# EAGLE design v3 Tensegrity Motherboard (EAGLE 9.6.2)
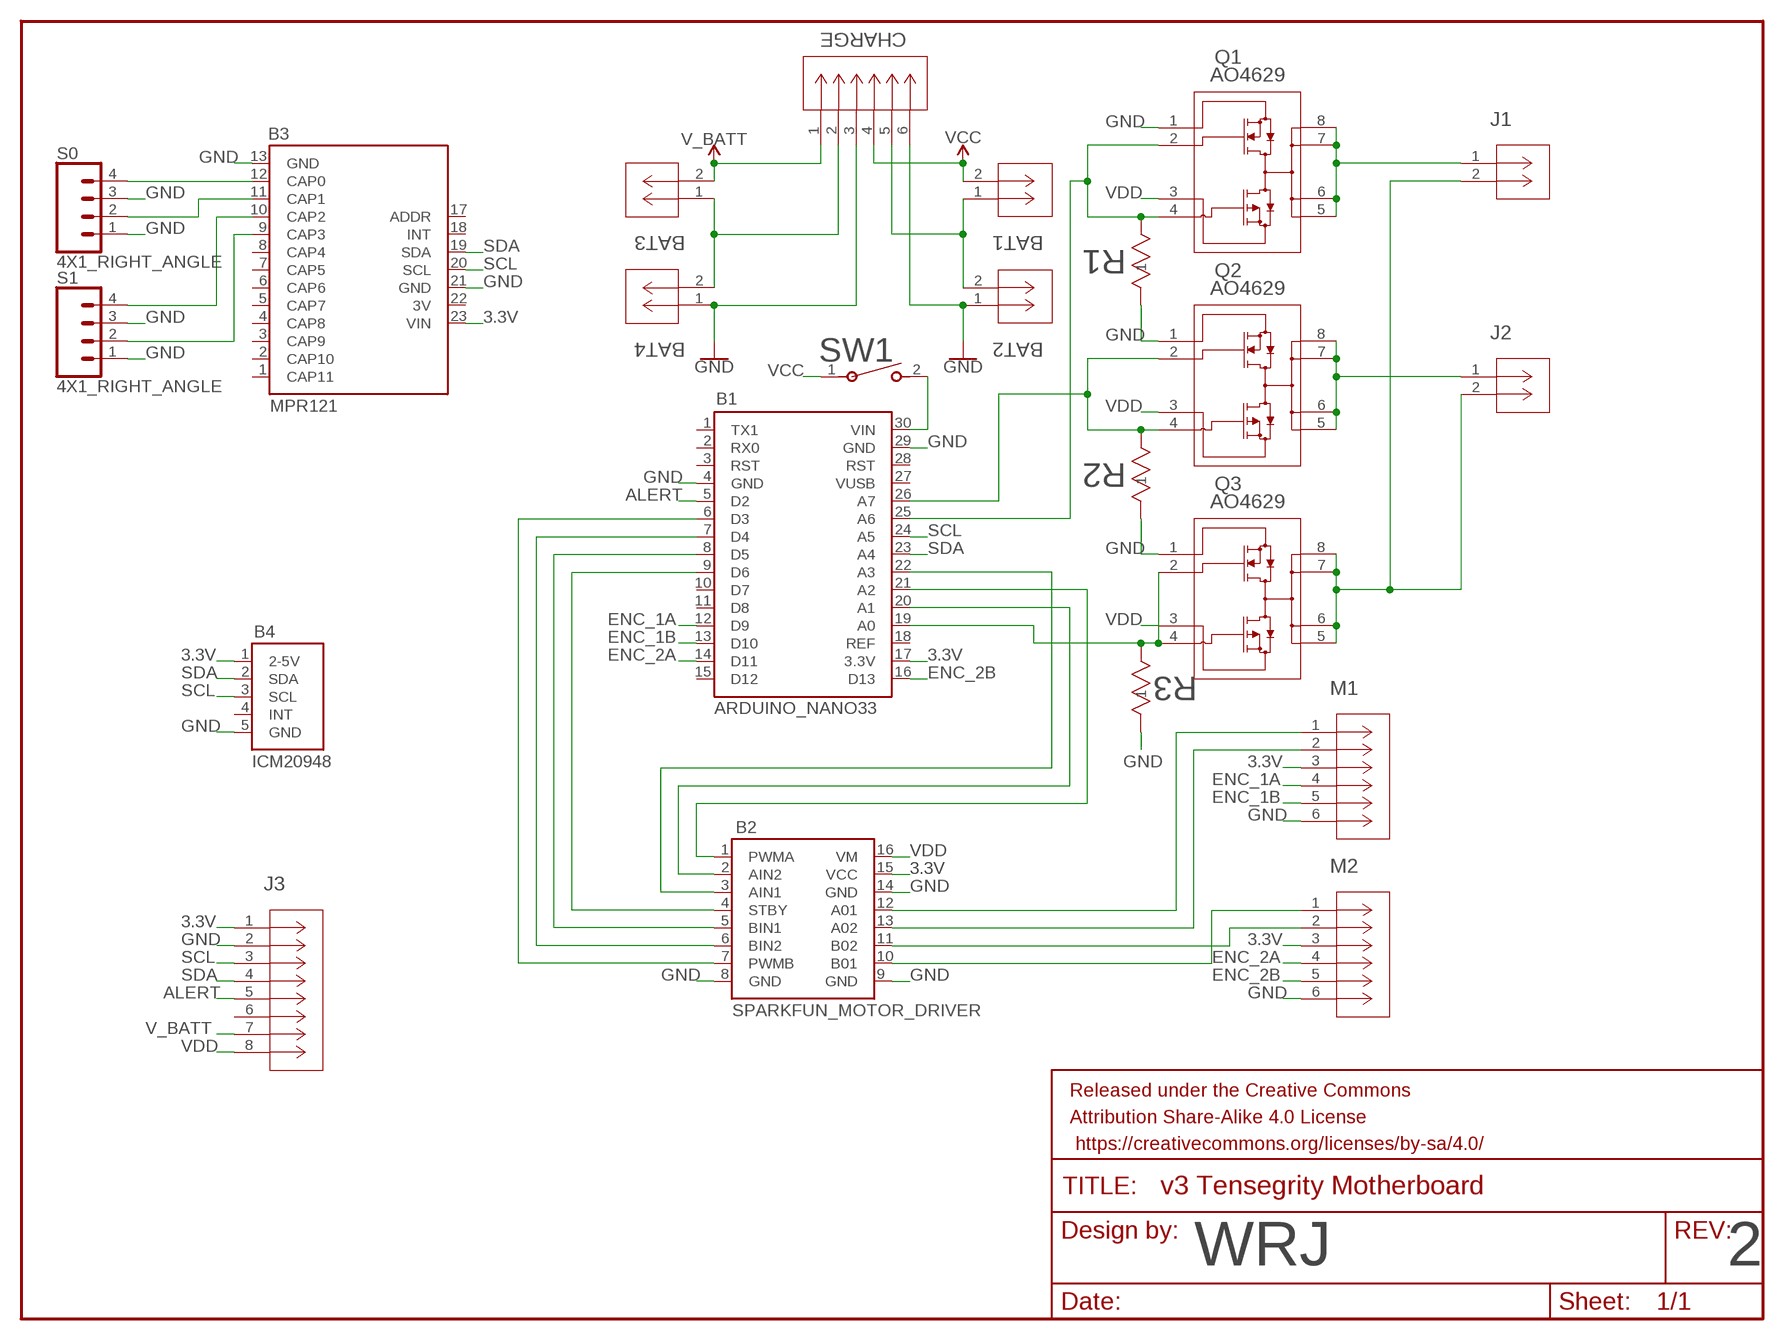
[diagram p0: schematic, sheet 1]

## Parts
B1  ARDUINO_NANO33  [HDRVR30W64P1524X254_2X15_3810X1778X851B]
B2  SPARKFUN_MOTOR_DRIVER  [HDRVR16W64P1524X254_2X8_2032X2032X254B]
B3  MPR121  [HDRVR26W64P1524X254_2X13_3302X1905X851B]
B4  ICM20948  [HDRVR5W64P254_1X5_1270X254X851B]
BAT1  S2B-PH-K-S(LF)(SN)  [CONN_S2B-PH-K-S_JST]
BAT2  S2B-PH-K-S(LF)(SN)  [CONN_S2B-PH-K-S_JST]
BAT3  S2B-PH-K-S(LF)(SN)  [CONN_S2B-PH-K-S_JST]
BAT4  S2B-PH-K-S(LF)(SN)  [CONN_S2B-PH-K-S_JST]
CHARGE  S6B-XH-A  [CONN_S6B-XH-A_JST]
FRAME1  FRAME-LETTER  [CREATIVE_COMMONS]
J1  S2B-XH-A-1(LF)(SN)  [CONN_S2B-XH-A-1(LF)(SN)_JST]
J2  S2B-XH-A-1(LF)(SN)  [CONN_S2B-XH-A-1(LF)(SN)_JST]
J3  PEC08SAAN  [CONN_XXC08SAAN_SUL]
M1  BM06B-SRSS-TB(LF)(SN)  [CONN_BM06B-SRSS-TB_JST]
M2  BM06B-SRSS-TB(LF)(SN)  [CONN_BM06B-SRSS-TB_JST]
Q1  AO4629  [SO8(SOP-8L)_AOS]
Q2  AO4629  [SO8(SOP-8L)_AOS]
Q3  AO4629  [SO8(SOP-8L)_AOS]
R1  RC0603FR-071KL  [RC0603N_YAG]
R2  RC0603FR-071KL  [RC0603N_YAG]
R3  RC0603FR-071KL  [RC0603N_YAG]
S0  4X1_RIGHT_ANGLE  [HDRRA4W64P254_1X4_1016X254X278B]
S1  4X1_RIGHT_ANGLE  [HDRRA4W64P254_1X4_1016X254X278B]
SW1  GPTS203212B  [SW_GPTS203212B_CWI]

## Nets
3.3V: B1.17(3.3V) B2.15(VCC) B3.23(VIN) B4.1(2-5V) J3.1 M1.3 M2.3
ALERT: B1.5(D2) J3.5
ENC_1A: B1.12(D9) M1.4
ENC_1B: B1.13(D10) M1.5
ENC_2A: B1.14(D11) M2.4
ENC_2B: B1.16(D13) M2.5
GND: B1.4(GND) B1.29(GND) B2.8(GND) B2.9(GND) B2.14(GND) B3.13(GND) B3.21(GND) B4.5(GND) BAT2.1 BAT4.1 CHARGE.3 CHARGE.6 J3.2 M1.6 M2.6 Q1.1 Q2.1 Q3.1 R1.1 R2.1 R3.1 S0.1 S0.3 S1.1 S1.3
N$1: BAT1.1 BAT2.2 CHARGE.5
N$2: BAT3.1 BAT4.2 CHARGE.2
N$3: B1.6(D3) B2.7(PWMB)
N$4: B1.7(D4) B2.6(BIN2)
N$5: B1.8(D5) B2.5(BIN1)
N$6: B1.9(D6) B2.4(STBY)
N$7: B1.21(A2) B2.1(PWMA)
N$8: B1.20(A1) B2.2(AIN2)
N$9: B1.22(A3) B2.3(AIN1)
N$10: B2.12(A01) M1.1
N$11: B2.13(A02) M1.2
N$12: B2.11(B02) M2.2
N$13: B2.10(B01) M2.1
N$14: B1.30(VIN) SW1.2
N$15: B3.12(CAP0) S0.4
N$16: B3.11(CAP1) S0.2
N$17: B3.10(CAP2) S1.4
N$18: B3.9(CAP3) S1.2
N$19: B1.26(A7) Q2.2 Q2.4 R2.2
N$20: B1.25(A6) Q1.2 Q1.4 R1.2
N$21: J1.2 J2.2 Q3.5 Q3.6 Q3.7 Q3.8
N$22: B1.19(A0) Q3.2 Q3.4 R3.2
N$23: J2.1 Q2.5 Q2.6 Q2.7 Q2.8
N$25: J1.1 Q1.5 Q1.6 Q1.7 Q1.8
SCL: B1.24(A5) B3.20(SCL) B4.3(SCL) J3.3
SDA: B1.23(A4) B3.19(SDA) B4.2(SDA) J3.4
V_BATT: BAT3.2 CHARGE.1 J3.7
VCC: BAT1.2 CHARGE.4 SW1.1
VDD: B2.16(VM) J3.8 Q1.3 Q2.3 Q3.3
Unconnected: B1.1(TX1) B1.2(RX0) B1.3(RST) B1.10(D7) B1.11(D8) B1.15(D12) B1.18(REF) B1.28(RST) B3.1(CAP11) B3.2(CAP10) B3.3(CAP9) B3.4(CAP8) B3.5(CAP7) B3.6(CAP6) B3.7(CAP5) B3.8(CAP4) B3.17(ADDR) B3.18(INT) B4.4(INT) J3.6

## Notes on the sheet
- WRJ | 2

## Power pins joined to a net without a drawn wire
3V: B3.22(3V)
VUSB: B1.27(VUSB)

## Library data of the parts
B1 = Arduino Nano 33 IoT:ARDUINO_NANO33: Arduino Nano 33 IoT
B2 = SparkFun Motor Driver - Dual TB6612FNG Breakout:SPARKFUN_MOTOR_DRIVER: This device is for the SparkFun Motor Driver - Dual TB6612FNG (with Headers). It allows users to design carrier boards for this commerical breakout.
B3 = MPR121:MPR121: Adafruit MPR121 Capacitive Sensing Breakout Board, for making carrier boards
B4 = ICM20948:ICM20948
BAT1-BAT4 = JST Connectors:S2B-PH-K-S(LF)(SN): JST PH Connector 2pos for LiPo battery Through-hole mounting Sold by DigiKey <https://www.digikey.com/en/products/detail/jst-sales-america-inc/S2B-PH-K-S/926626>; COPYRIGHT: Copyright (C) 2024 Ultra Librarian. All rights reserved.; MANUFACTURER_PART_NUMBER: S2B-PH-K-S(LF)(SN); MFR_NAME: JST
CHARGE = JST Connectors:S6B-XH-A: JST XH connector for LiPo battery charging. Can support balance charging for 2 packs of 2S LiPo batteries via ViFly 2S battery charger <https://viflydrone.com/products/vifly-toothstor-4-port-2s-balance-charger-with-storage-mode?variant=48130105639208>. Through-hole connector sold by Digikey <https://www.digikey.com/en/products/detail/jst-sales-america-inc/S6B-XH-A/1651034>.; COPYRIGHT: Copyright (C) 2024 Ultra Librarian. All rights reserved.; MANUFACTURER_PART_NUMBER: S6B-XH-A; MFR_NAME: JST
FRAME1 = SparkFun-Aesthetics:FRAME-LETTER: Schematic Frame - Letter Standard 8.5x11 US Letter frame
J1 J2 = JST Connectors:S2B-XH-A-1(LF)(SN): JST XH 2pos through-hole connector sold by DigiKey <https://www.digikey.com/en/products/detail/jst-sales-america-inc/S2B-XH-A-1/9961922> for EP Magnet connector.; COPYRIGHT: Copyright (C) 2024 Ultra Librarian. All rights reserved.; MANUFACTURER_PART_NUMBER: S2B-XH-A-1(LF)(SN); MFR_NAME: JST
J3 = Headers:PEC08SAAN: Male header pins from DigiKey <https://www.digikey.com/en/products/detail/sullins-connector-solutions/PEC08SAAN/859161>.; COPYRIGHT: Copyright (C) 2024 Ultra Librarian. All rights reserved.; MANUFACTURER_PART_NUMBER: PEC08SAAN; MFR_NAME: Sullins; TYPE: Headers, Male Pins
M1 M2 = JST Connectors:BM06B-SRSS-TB(LF)(SN): JST SH 6pos connector surface mount for Pololu Micro Metal Gearmotor with Encoder <https://www.pololu.com/product/5192>. Connector sold by DigiKey <https://www.digikey.com/en/products/detail/jst-sales-america-inc/BM06B-SRSS-TB/926698>.; COPYRIGHT: Copyright (C) 2024 Ultra Librarian. All rights reserved.; MANUFACTURER_PART_NUMBER: BM06B-SRSS-TB(LF)(SN); MFR_NAME: JST
Q1-Q3 = Transistors:AO4629: MOSFET N/P-CH 30V 6A/5.5A AO4629 <https://www.digikey.com/en/products/detail/alpha-omega-semiconductor-inc/AO4629/3152394>.; COPYRIGHT: Copyright (C) 2024 Ultra Librarian. All rights reserved.; MANUFACTURER_PART_NUMBER: AO4629; MFR_NAME: Alpha and Omega Semiconductor
R1-R3 = Resistors:RC0603FR-071KL: 1kΩ resistor 311-1.00KHRTR-ND from DigiKey <https://www.digikey.com/en/products/detail/yageo/RC0603FR-071KL/726843>.; COPYRIGHT: Copyright (C) 2024 Ultra Librarian. All rights reserved.; MANUFACTURER_PART_NUMBER: RC0603FR-071KL; MFR_NAME: Yageo
S0 S1 = 4x1 male headers right angle:4X1_RIGHT_ANGLE
SW1 = Switches:GPTS203212B: SPST Pushbutton Off-On switch GPTS203212B <https://www.digikey.com/en/products/detail/cw-industries/GPTS203212B/3190592> by CW Industries.; COPYRIGHT: Copyright (C) 2024 Ultra Librarian. All rights reserved.; MANUFACTURER_PART_NUMBER: GPTS203212B; MFR_NAME: CW Industries; TYPE: Pushbutton Switches

## Board
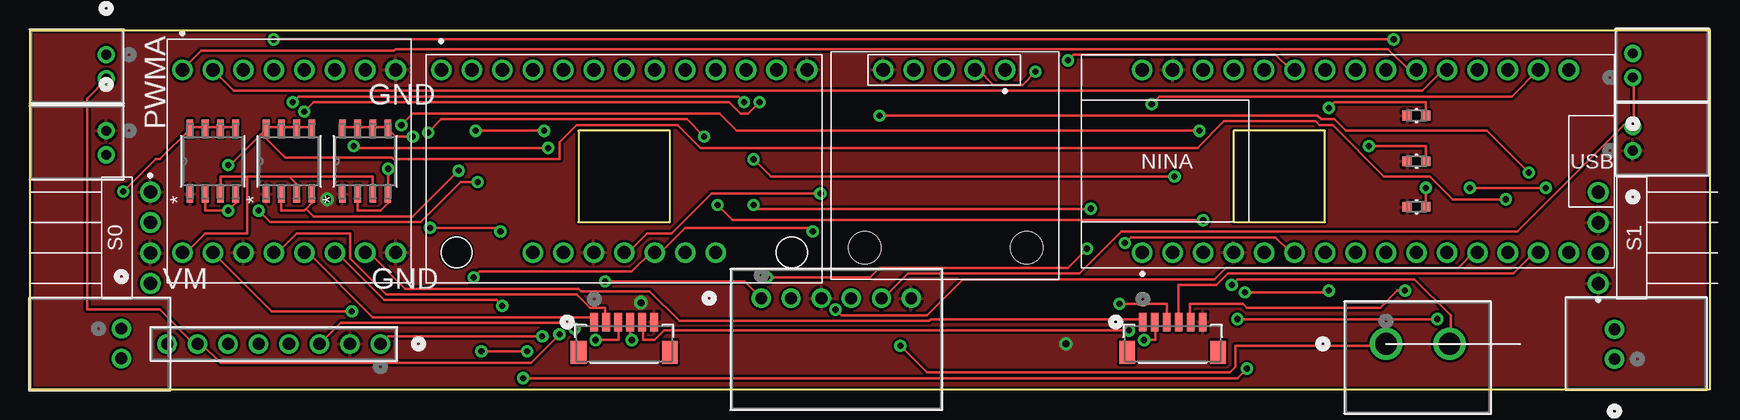
[diagram p1: board, top side]
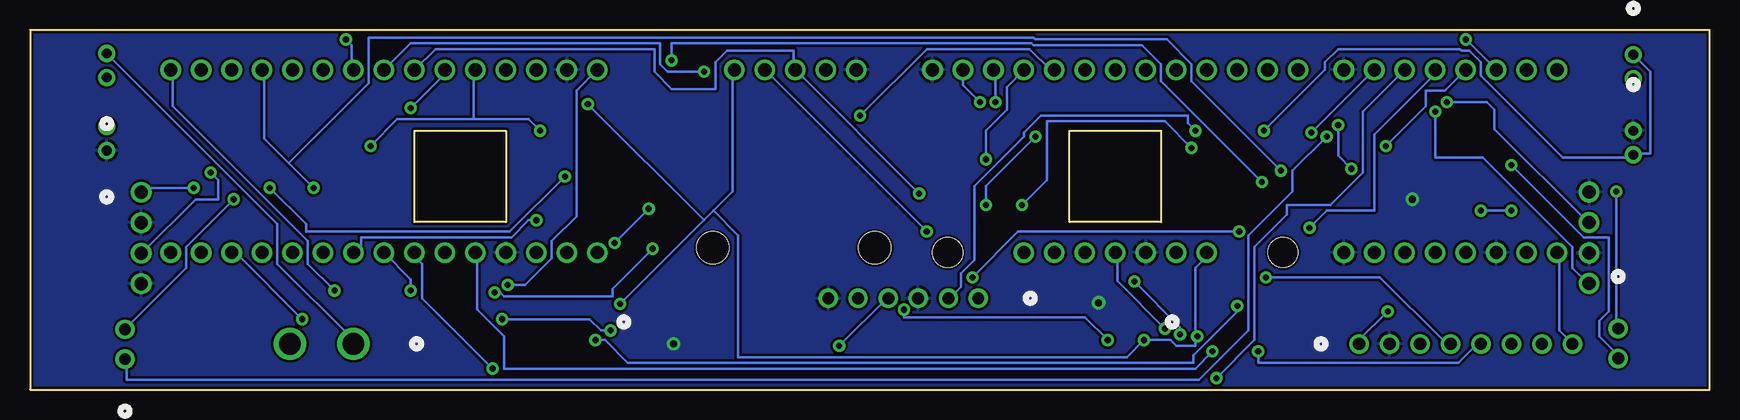
[diagram p2: board, bottom side, seen from below]

Size 140 x 30 mm. Coordinates in mm from the lower left corner, seen from the top.
Outline: 0,0 0,30 140,30 140,0 0,0
Outline: 45.72,13.97 53.34,13.97 53.34,21.59 45.72,21.59 45.72,13.97
Outline: 100.33,13.97 107.95,13.97 107.95,21.59 100.33,21.59 100.33,13.97
Copper layers (1*16): Top 0.035mm / dielectric 1.5mm / Bottom 0.035mm
Design rules "SparkFun": minimum track width 8mil, minimum drill 20mil, track to track 8mil, track to pad 8mil, pad to pad 8mil, via to via 8mil, smd to smd 8mil, copper to edge 8mil, drill to drill 8mil, minimum pad ring 12mil, minimum via ring 10mil, stop-mask expansion 4mil, vias tented up to drill 20mil, thermal gap 10mil

### Footprints (pad centres in the part's own frame; a part is rotated, then mirrored left to right if it is on the bottom)
HDRVR30W64P1524X254_2X15_3810X1778X851B = drill 1.105 pad 1.705: 1 0,0; 2 2.54,0; 3 5.08,0; 4 7.62,0; 5 10.16,0; 6 12.7,0; 7 15.24,0; 8 17.78,0; 9 20.32,0; 10 22.86,0; 11 25.4,0; 12 27.94,0; 13 30.48,0; 14 33.02,0; 15 35.56,0; 16 35.56,15.24; 17 33.02,15.24; 18 30.48,15.24; 19 27.94,15.24; 20 25.4,15.24; 21 22.86,15.24; 22 20.32,15.24; 23 17.78,15.24; 24 15.24,15.24; 25 12.7,15.24; 26 10.16,15.24; 27 7.62,15.24; 28 5.08,15.24; 29 2.54,15.24; 30 0,15.24
HDRVR16W64P1524X254_2X8_2032X2032X254B = drill 1.105 pad 1.705: 1 -8.89,7.62; 2 -6.35,7.62; 3 -3.81,7.62; 4 -1.27,7.62; 5 1.27,7.62; 6 3.81,7.62; 7 6.35,7.62; 8 8.89,7.62; 9 8.89,-7.62; 10 6.35,-7.62; 11 3.81,-7.62; 12 1.27,-7.62; 13 -1.27,-7.62; 14 -3.81,-7.62; 15 -6.35,-7.62; 16 -8.89,-7.62
HDRVR26W64P1524X254_2X13_3302X1905X851B = drill 1.105 pad 1.705: 1 0,0; 2 2.54,0; 3 5.08,0; 4 7.62,0; 5 10.16,0; 6 12.7,0; 7 15.24,0; 8 17.78,0; 9 20.32,0; 10 22.86,0; 11 25.4,0; 12 27.94,0; 13 30.48,0; 17 22.86,-15.24; 18 20.32,-15.24; 19 17.78,-15.24; 20 15.24,-15.24; 21 12.7,-15.24; 22 10.16,-15.24; 23 7.62,-15.24 | hole 2.5: 1.27,-15.24; 29.21,-15.24
HDRVR5W64P254_1X5_1270X254X851B = drill 1.105 pad 1.705: 1 0,0; 2 2.54,0; 3 5.08,0; 4 7.62,0; 5 10.16,0 | hole 2.7: -1.8,14.85; 11.7,14.85
CONN_S2B-PH-K-S_JST = drill 0.813 pad 1.321: 1 0,0; 2 2.007,0
CONN_S6B-XH-A_JST = drill 0.991 pad 1.499: 1 0,0; 2 2.489,0; 3 5.004,0; 4 7.493,0; 5 10.008,0; 6 12.497,0
CONN_S2B-XH-A-1(LF)(SN)_JST = drill 0.991 pad 1.499: 1 0,0; 2 2.489,0
CONN_XXC08SAAN_SUL = drill 1.016 pad 1.524: 1 0,0; 2 2.54,0; 3 5.08,0; 4 7.62,0; 5 10.16,0; 6 12.7,0; 7 15.24,0; 8 17.78,0
CONN_BM06B-SRSS-TB_JST = smd 0.66 x 1.549: 1 -2.5,1.83; 2 -1.5,1.83; 3 -0.5,1.83; 4 0.5,1.83; 5 1.5,1.83; 6 2.5,1.83 | smd 1.295 x 1.905: 7 -3.8,-0.695; 8 3.8,-0.695
SO8(SOP-8L)_AOS = smd 1.46 x 0.559: 1 -2.724,1.905; 2 -2.724,0.635; 3 -2.724,-0.635; 4 -2.724,-1.905; 5 2.724,-1.905; 6 2.724,-0.635; 7 2.724,0.635; 8 2.724,1.905
RC0603N_YAG = smd 0.762 x 0.813: 1 -0.775,0; 2 0.775,0
HDRRA4W64P254_1X4_1016X254X278B = drill 1.105 pad 1.705: 1 0,0; 2 2.54,0; 3 5.08,0; 4 7.62,0
SW_GPTS203212B_CWI = drill 1.8 pad 2.5: 1 0,0; 2 5.309,0

### Placement (x,y rotation side)
B1  92.71,11.43 0 top
B2  21.59,19.05 0 top
B3  34.29,26.67 0 top
B4  81.28,26.67 180 top
BAT1  133.6,26.04 90 top
BAT2  133.6,19.94 90 top
BAT3  6.35,27.94 270 top
BAT4  6.35,21.59 270 top
CHARGE  60.96,7.62 0 top
FRAME1  49.53,-12.7 0 top  (outside the outline)
J1  7.62,5.08 270 top
J2  132.08,2.54 90 top
J3  29.21,3.81 180 top
M1  49.53,3.81 0 top
M2  95.25,3.81 0 top
Q1  15.24,19.05 90 top
Q2  27.94,19.05 90 top
Q3  21.59,19.05 90 top
R1  115.57,22.86 0 top
R2  115.57,19.05 0 top
R3  115.57,15.24 0 top
S0  10.03,16.48 270 top
S1  130.73,8.84 90 top
SW1  113.03,3.81 0 top

### Tracks (layer width: path | path; a pad name or v marks a point on that pad's centre or on a via)
3.3V  (via drill 0.51)
  Top 0.203: v47.15,4.13 49.05,4.13 49.05,5.56 M1.3 | J3.1 29.84,4.45 v42.7,4.45 | B2.15 20.16,6.51 v26.83,6.51 | v90.81,7.14 94.77,7.14 94.77,5.71 M2.3 | B1.17 123.51,24.45 94.14,24.45 v93.5,23.81
  Bottom 0.203: 42.86,4.45 42.86,10.16 41.91,11.11 B3.23 | 42.86,4.45 42.86,3.65 44.45,3.65 44.93,4.13 v47.15,4.13 48.58,2.7 80.96,2.7 80.96,12.86 83.03,14.92 | 42.86,4.45 v42.7,4.45 | v26.83,6.51 29.21,4.13 J3.1 | 83.03,14.92 81.44,16.51 81.44,26.51 B4.1 | 83.03,14.92 83.82,14.13 | 83.82,14.13 v90.81,7.14 | 83.82,14.13 v93.5,23.81
ALERT  (via drill 0.51)
  Top 0.203: v41.43,3.17 v37.62,3.17
  Bottom 0.203: J3.5 19.68,3.81 19.68,3.49 20.95,2.22 37.62,2.22 v37.62,3.17 | v41.43,3.17 42.86,1.75 100.49,1.75 100.49,4.45 102.71,6.67 102.71,11.27 B1.5
ENC_1A  (via drill 0.51)
  Top 0.203: v50.16,4.13 50.01,4.13 50.01,5.56 M1.4 | v67.15,6.67 67.63,6.19 74.77,6.19 77.79,9.21 98.74,9.21 99.69,10.16 119.06,10.16 120.33,11.43 B1.12
  Bottom 0.203: v50.16,4.13 52.07,6.03 67.15,6.03 v67.15,6.67
ENC_1B  (via drill 0.51)
  Top 0.203: v91.6,4.92 52.86,4.92 52.07,4.13 51.12,4.13 51.12,5.56 M1.5 | v117.32,5.87 v100.65,5.87
  Bottom 0.203: v91.6,4.92 92.39,4.92 93.34,5.87 v100.65,5.87 | v117.32,5.87 122.87,11.43 B1.13
ENC_2A
  Top 0.203: B1.14 125.41,11.43 123.67,9.68 99.85,9.68 98.9,8.73 95.73,8.73 95.73,5.71 M2.4
ENC_2B  (via drill 0.51)
  Top 0.203: v114.62,8.26 113.98,8.26 112.55,6.83 101.44,6.83 101.12,7.14 96.68,7.14 96.68,5.71 M2.5
  Bottom 0.203: v114.62,8.26 116.84,10.48 116.84,12.38 128.11,23.65 128.11,26.51 B1.16
GND  (via drill 0.6)
  other vias: 24.77,15.88 50.93,7.24 86.36,3.81
  pour Top: 0,0 0,30 140,30 140,0
  pour Bottom: 0,0 0,30 140,30 140,0
N$1
  Top 0.203: BAT1.1 133.67,26.04 133.67,22.07 BAT2.2 133.51,22.07 132.87,22.07 123.98,13.18 90.96,13.18 87.47,9.68 73.18,9.68 71.12,7.62 CHARGE.5
N$2  (via drill 0.51)
  Top 0.203: v37.15,21.59 v42.86,21.59
  Bottom 0.203: BAT3.1 4.92,26.51 4.92,19.68 6.35,19.68 BAT4.2 6.35,19.37 12.22,19.37 19.05,26.19 19.05,27.3 20,28.26 20.64,28.26 20.8,28.42 30.96,28.42 32.07,27.3 32.07,26.67 v37.15,21.59 | v42.86,21.59 43.5,22.23 43.5,22.86 55.72,22.86 57.15,21.43 57.15,21.11 61.28,16.99 61.28,10.79 62.39,9.68 62.39,8.57 63.34,7.62 CHARGE.2
N$3  (via drill 0.51)
  Top 0.203: v33.18,21.43 34.29,22.54 54.77,22.54 v56.2,21.11 | v60.33,15.4 60.64,15.08 v88.42,15.08 | v91.28,12.22 91.76,12.7 103.82,12.7 105.09,11.43 B1.6
  Bottom 0.203: v33.18,21.43 B2.7 | v56.2,21.11 60.33,16.99 v60.33,15.4 | v91.28,12.22 v88.42,15.08
N$4  (via drill 0.51)
  Top 0.203: v41.12,0.95 100.65,0.95 v101.44,1.75
  Bottom 0.203: B2.6 28.89,23.18 28.89,18.1 31.59,15.4 35.24,15.4 35.24,14.61 37.94,11.91 37.94,4.13 v41.12,0.95 | v101.44,1.75 107.31,7.62 107.31,10.48 107.95,11.11 B1.7
N$5  (via drill 0.51)
  Top 0.203: v108.27,8.26 108.11,8.1 v101.28,8.1 | v88.11,11.75 86.52,10.16 70.8,10.16 70.01,9.37 v61.44,9.37 | v39.21,13.18 38.89,13.49 v33.34,13.49
  Bottom 0.203: B1.8 108.27,9.21 v108.27,8.26 | v101.28,8.1 100.81,8.1 100.49,7.78 91.44,7.78 91.44,8.41 v88.11,11.75 | v61.44,9.37 57.63,13.18 v39.21,13.18 | v33.34,13.49 31.91,14.92 27.94,14.92 27.94,21.27 22.86,26.35 B2.5
N$6  (via drill 0.51)
  Top 0.203: v26.99,20.32 27.15,20.16 v43.18,20.16 | v57.31,15.4 58.58,14.13 v97.79,14.13
  Bottom 0.203: B2.4 22.07,24.92 23.65,24.92 23.65,23.65 v26.99,20.32 | v43.18,20.16 45.4,22.38 55.24,22.38 55.24,17.46 v57.31,15.4 | v97.79,14.13 98.42,14.13 99.85,12.7 112.39,12.7 112.39,12.06 B1.9
N$7
  Top 0.203: B2.1 14.29,28.26 30.32,28.26 30.48,28.42 113.19,28.42 114.94,26.67 B1.21
N$8
  Top 0.203: B2.2 16.99,24.92 116.05,24.92 117.79,26.67 B1.20
N$9  (via drill 0.51)
  Top 0.203: v113.67,29.21 v20.32,29.21
  Bottom 0.203: v20.32,29.21 B2.3 | v113.67,29.21 113.19,28.73 113.19,26.83 B1.22
N$10
  Top 0.203: B2.12 23.18,11.43 28.57,6.03 46.67,6.03 46.99,5.71 M1.1
N$11
  Top 0.203: B2.13 20.64,11.43 22.23,13.02 26.67,13.02 26.67,10.95 29.69,7.94 45.56,7.94 46.67,6.83 47.94,6.83 47.94,5.71 M1.2
N$12  (via drill 0.51)
  Top 0.203: v92.87,4.13 93.82,4.13 93.82,5.56 M2.2 | v39.37,6.99 38.89,7.46 29.53,7.46 25.56,11.43 B2.11
  Bottom 0.203: v92.87,4.13 92.08,4.13 90.17,2.22 43.02,2.22 43.02,2.86 39.37,6.51 v39.37,6.99
N$13
  Top 0.203: B2.10 28.26,11.43 31.27,8.41 45.72,8.41 45.94,8.19 51.66,8.19 54.13,5.71 74.93,5.71 75.09,5.87 92.55,5.87 92.71,5.71 M2.1
N$14  (via drill 0.51)
  Top 0.203: v100.17,8.73 100.65,9.21 115.41,9.21 118.43,6.19 118.43,3.81 SW1.2
  Bottom 0.203: B1.30 94.46,24.92 94.46,14.45 96.52,12.38 96.52,10.95 98.74,8.73 v100.17,8.73
N$15  (via drill 0.51)
  Top 0.203: v22.86,23.18 23.65,23.97 58.26,23.97 59.21,23.02 59.85,23.02 v60.8,23.97
  Bottom 0.203: v22.86,23.18 22.86,19.37 18.89,19.37 11.43,11.91 11.43,10.16 10.16,8.89 S0.4 | v60.8,23.97 62.23,25.4 B3.12
N$16  (via drill 0.51)
  Top 0.203: v21.91,23.97 22.38,24.45 59.05,24.45 v59.53,23.97
  Bottom 0.203: v21.91,23.97 18.57,23.97 17.94,23.34 17.94,21.75 10.16,13.97 S0.2 | v59.53,23.97 59.53,26.51 B3.11
N$17  (via drill 0.51)
  Top 0.203: v60.33,19.21 61.75,17.78 v95.41,17.78 | v126.36,16.83 v120.02,16.83
  Bottom 0.203: B3.10 58.58,25.24 58.58,23.34 60.33,21.59 v60.33,19.21 | v95.41,17.78 100.01,13.18 117,13.18 117,13.81 v120.02,16.83 | v126.36,16.83 130.65,16.83 130.65,16.51 S1.4
N$18  (via drill 0.51)
  Top 0.203: v124.94,18.1 121.44,21.59 109.7,21.59 108.74,22.54 107.63,22.54 107.31,22.86 v70.8,22.86
  Bottom 0.203: v124.94,18.1 124.3,17.46 124.3,15.88 126.21,15.88 130.65,11.43 S1.2 | v70.8,22.86 65.25,28.42 56.67,28.42 54.93,26.67 B3.9
N$19  (via drill 0.51)
  Top 0.203: Q2.2 27.3,14.92 29.21,14.92 29.84,15.56 Q2.4 v29.84,18.41 | v111.6,20.32 116.36,20.32 116.36,19.05 R2.2 | v30.96,22.07 31.91,23.02 57.47,23.02 58.9,21.59 v97.47,21.59
  Bottom 0.203: v111.6,20.32 109.38,22.54 103.03,22.54 | 103.03,22.54 103.03,26.51 B1.26 | v29.84,18.41 30.96,19.53 v30.96,22.07 | v97.47,21.59 98.42,22.54 103.03,22.54
N$20  (via drill 0.51)
  Top 0.203: Q1.2 14.61,14.92 v16.51,14.92 17.14,15.56 Q1.4 | v108.27,23.5 108.74,23.97 116.36,23.97 116.36,22.86 R1.2 | v19.05,14.92 20,13.97 32.54,13.97 35.88,17.3 v37.31,17.3 | v86.52,27.46 87,27.94 103.82,27.94 105.09,26.67 B1.25
  Bottom 0.203: v108.27,23.5 105.41,26.35 B1.25 | v19.05,14.92 v16.51,14.92 | v37.31,17.3 45.72,25.72 45.72,27.15 47.31,28.73 56.36,28.73 56.52,28.89 86.52,28.89 v86.52,27.46
N$21  (via drill 0.51)
  Top 0.203: 20.95,21.91 19.68,21.91 Q3.8 19.68,21.75 19.21,21.27 | 20.95,21.91 22.23,21.91 | 20.95,21.91 Q3.7 | 22.23,21.91 23.5,21.91 Q3.5 | 22.23,21.91 Q3.6 | 19.21,21.27 16.67,18.73 v16.51,18.73 | v123.03,15.88 118.59,15.88 116.68,17.78 112.87,17.78 108.58,22.07 107.47,22.07 107.16,22.38 99.54,22.38 97.31,20.16 55.88,20.16 53.98,22.07 45.56,22.07 44.13,20.64 44.13,19.21 30.32,19.21 30.16,19.37 21.27,19.37 19.37,21.27 19.21,21.27
  Bottom 0.203: v16.51,18.73 10.48,12.7 8.41,12.7 8.41,6.51 9.21,5.71 9.21,4.45 7.62,2.86 J1.2 | v123.03,15.88 127,11.91 127,10.16 132.08,5.08 J2.2
N$22  (via drill 0.51)
  Top 0.203: Q3.2 20.95,14.92 22.86,14.92 23.02,15.08 | 23.02,15.08 23.5,15.56 Q3.4 | v116.36,16.83 116.36,15.24 R3.2 | 23.02,15.08 23.65,14.45 31.91,14.45 v35.72,18.26
  Bottom 0.203: 118.43,18.89 120.49,20.95 120.49,26.51 B1.19 | 118.43,18.89 v116.36,16.83 | v35.72,18.26 43.18,25.72 43.18,27.15 45.24,29.21 56.2,29.21 56.36,29.37 111.76,29.37 111.76,25.56 118.43,18.89
N$23  (via drill 0.51)
  Top 0.203: 27.3,21.91 26.04,21.91 Q2.8 | 27.3,21.91 28.57,21.91 | 27.3,21.91 Q2.7 | 28.57,21.91 29.84,21.91 Q2.5 29.84,21.75 30.48,21.11 v31.91,21.11 | 28.57,21.91 Q2.6
  Bottom 0.203: v31.91,21.11 34.77,18.26 34.77,16.51 38.42,12.86 38.42,4.92 42.55,0.79 131.92,0.79 131.92,2.38 J2.1
N$25  (via drill 0.51)
  Top 0.203: 14.61,21.91 13.34,21.91 Q1.8 13.34,21.75 10.79,19.21 10.48,19.21 v7.78,16.51 | 14.61,21.91 15.88,21.91 | 14.61,21.91 Q1.7 | 15.88,21.91 17.14,21.91 Q1.5 | 15.88,21.91 Q1.6
  Bottom 0.203: v7.78,16.51 7.78,5.24 J1.1
SCL  (via drill 0.51)
  Top 0.203: J3.3 25.88,5.56 44.93,5.56 v45.4,5.08 | v65.88,16.35 56.83,16.35 53.5,13.02 51.44,13.02 49.85,11.43 B3.20
  Bottom 0.203: v45.4,5.08 49.37,9.05 49.37,11.27 B3.20 | v65.88,16.35 B4.3 76.36,26.83 76.36,28.26 81.92,28.26 82.87,27.3 82.87,25.08 86.52,25.08 87.95,26.51 87.95,28.42 106.2,28.42 B1.24
SDA  (via drill 0.51)
  Top 0.203: v36.99,9.37 37.47,9.84 50.16,9.84 51.75,11.43 B3.19 52.55,11.43 54.61,13.49 64.93,13.49 v65.25,13.18 | v83.82,26.51 82.71,25.4 80.33,25.4 79.06,26.67 B4.2
  Bottom 0.203: J3.4 22.23,3.81 22.23,4.13 27.46,9.37 v36.99,9.37 | v65.25,13.18 B4.2 | B1.23 108.27,28.89 87.47,28.89 87.47,27.15 86.84,26.51 v83.82,26.51
V_BATT  (via drill 0.51)
  Top 0.203: BAT3.2 6.35,25.88 4.76,24.29 4.76,6.67 10.79,6.67 13.65,3.81 J3.7 14.29,3.81 15.88,2.22 41.75,2.22 v44.13,4.6 | CHARGE.1 59.56,9.02 v47.94,9.02
  Bottom 0.203: v47.94,9.02 44.13,5.21 v44.13,4.6
VCC  (via drill 0.51)
  Top 0.203: v72.55,3.65 74.77,1.43 100.01,1.43 100.49,1.91 100.49,3.65 112.87,3.65 SW1.1
  Bottom 0.203: SW1.1 113.03,4.13 119.38,10.48 119.38,13.81 133.51,27.94 BAT1.2 | v72.55,3.65 68.58,7.62 CHARGE.4
VDD
  Top 0.203: Q1.3 15.88,17.78 18.1,17.78 | 21.59,17.78 18.1,17.78 | 21.59,17.78 22.38,16.99 22.38,16.35 22.23,16.35 Q3.3 | Q2.3 28.57,17.78 21.59,17.78 | 18.1,17.78 18.1,13.02 14.61,13.02 13.02,11.43 B2.16
  Bottom 0.203: J3.8 12.54,4.92 12.54,11.27 B2.16

### Text on the board
tPlace: WRJ
tNames: GND | PWMA | VM | GND